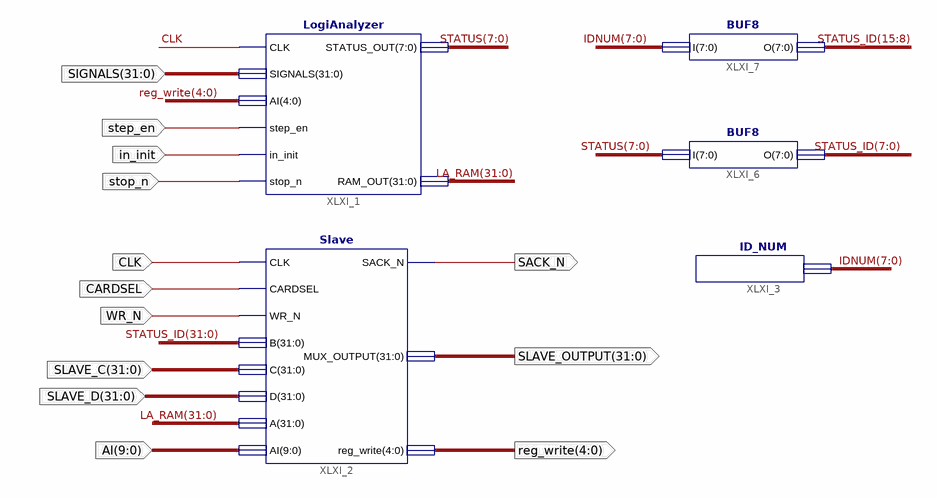
[diagram p0: schematic sheet 1]
// Xilinx ISE schematic monitor.sch (spartan6) as structural Verilog: 5 symbols, 13 ports
module monitor (
  input  [31:0] SIGNALS,
  input  step_en,
  input  in_init,
  input  stop_n,
  input  CLK,
  input  CARDSEL,
  input  WR_N,
  input  [31:0] SLAVE_C,
  input  [31:0] SLAVE_D,
  input  [9:0] AI,
  output SACK_N,
  output [4:0] reg_write,
  output [31:0] SLAVE_OUTPUT
);

  wire [7:0] IDNUM, STATUS;
  wire [31:0] LA_RAM, STATUS_ID;

  LogiAnalyzer XLXI_1 (
    .CLK(CLK), .SIGNALS(SIGNALS), .AI(reg_write), .step_en(step_en), .in_init(in_init), .stop_n(stop_n),
    .STATUS_OUT(STATUS), .RAM_OUT(LA_RAM));
  Slave XLXI_2 (
    .CLK(CLK), .CARDSEL(CARDSEL), .WR_N(WR_N), .B(STATUS_ID), .C(SLAVE_C), .D(SLAVE_D), .A(LA_RAM), .AI(AI),
    .SACK_N(SACK_N), .MUX_OUTPUT(SLAVE_OUTPUT), .reg_write(reg_write));
  ID_NUM XLXI_3 (.ID(IDNUM));
  BUF8 XLXI_6 (.I(STATUS), .O(STATUS_ID[7:0]));
  BUF8 XLXI_7 (.I(IDNUM), .O(STATUS_ID[15:8]));
endmodule
